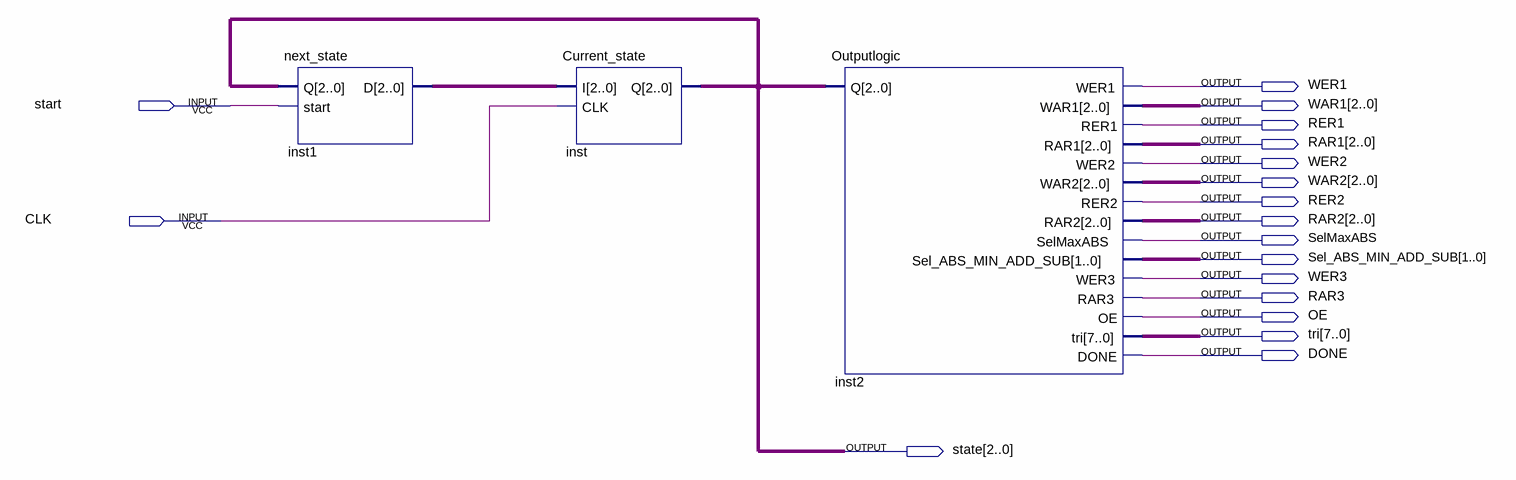
[diagram p0: schematic sheet]
// Quartus schematic Controller.bdf as structural Verilog: 3 symbols, 18 pins
module Controller (
  input  start,
  input  CLK,
  output WER1,
  output [2:0] WAR1,
  output RER1,
  output [2:0] RAR1,
  output WER2,
  output [2:0] WAR2,
  output RER2,
  output [2:0] RAR2,
  output SelMaxABS,
  output [1:0] Sel_ABS_MIN_ADD_SUB,
  output WER3,
  output RAR3,
  output OE,
  output [7:0] \tri ,
  output DONE,
  output [2:0] state
);

  wire [2:0] inst1_d;

  next_state inst1 (.Q(state), .start(start), .D(inst1_d));
  Current_state inst (.I(inst1_d), .CLK(CLK), .Q(state));
  Outputlogic inst2 (
    .Q(state), .WER1(WER1), .WAR1(WAR1), .RER1(RER1), .RAR1(RAR1), .WER2(WER2), .WAR2(WAR2), .RER2(RER2),
    .RAR2(RAR2), .SelMaxABS(SelMaxABS), .Sel_ABS_MIN_ADD_SUB(Sel_ABS_MIN_ADD_SUB), .WER3(WER3), .RAR3(RAR3),
    .OE(OE), .\tri (\tri ), .DONE(DONE));
endmodule
